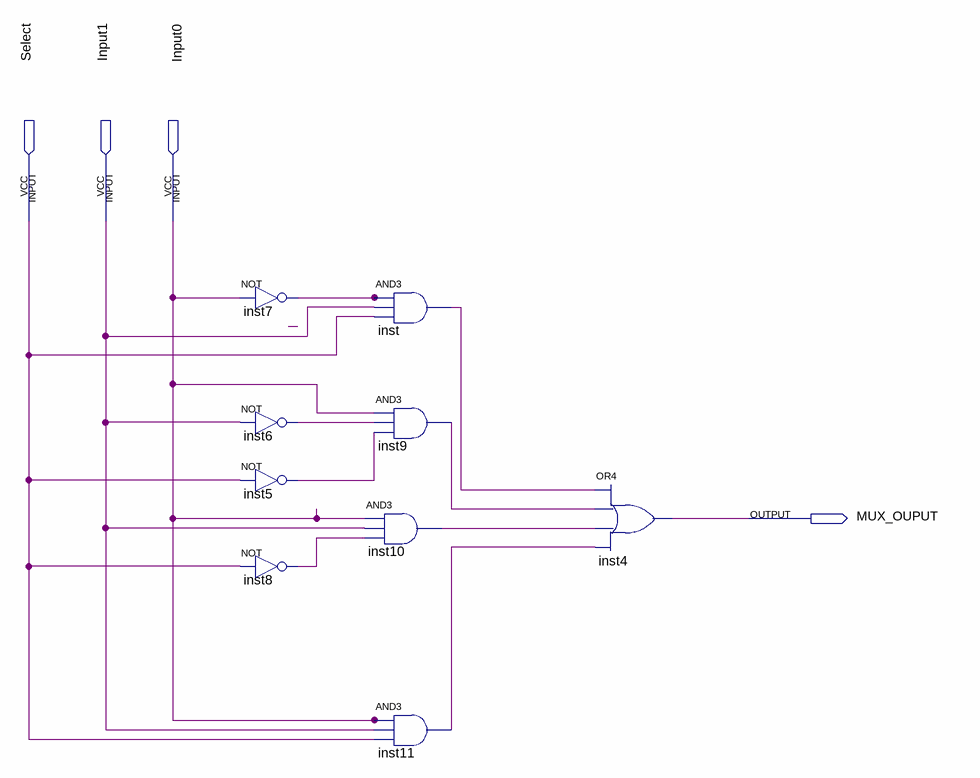
[diagram p0: schematic sheet]
// Quartus schematic mux.bdf as structural Verilog: 9 symbols, 4 pins
module mux (
  input  Select,
  input  Input1,
  input  Input0,
  output MUX_OUPUT
);

  wire inst5_out, inst6_out, inst7_out, inst8_out, inst9_out, inst10_out, inst11_out, inst_out;

  not inst7 (inst7_out, Input0);
  not inst6 (inst6_out, Input1);
  not inst5 (inst5_out, Select);
  not inst8 (inst8_out, Select);
  and inst (inst_out, inst7_out, Input1, Select);
  and inst9 (inst9_out, Input0, inst6_out, inst5_out);
  and inst10 (inst10_out, Input0, Input1, inst8_out);
  and inst11 (inst11_out, Input0, Input1, Select);
  or inst4 (MUX_OUPUT, inst_out, inst9_out, inst10_out, inst11_out);
endmodule
